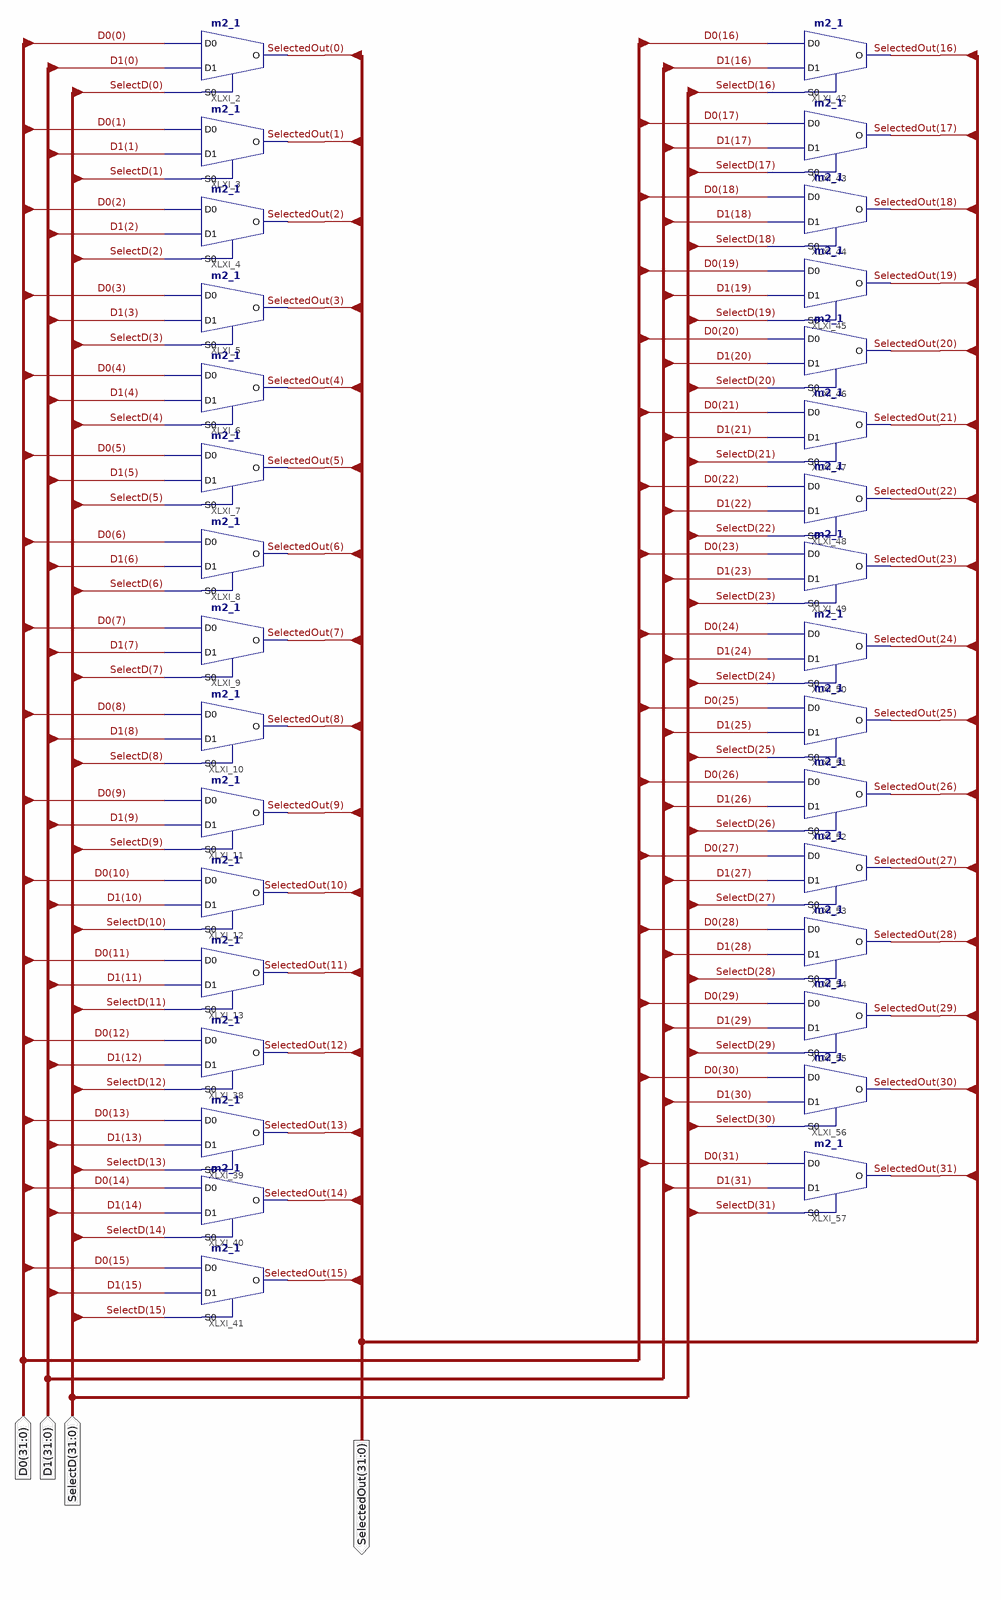
[diagram p0: schematic sheet 1]
// Xilinx ISE schematic Selector32Bit.sch (virtex4) as structural Verilog: 32 symbols, 4 ports
module Selector32Bit (
  input  [31:0] D0,
  input  [31:0] D1,
  input  [31:0] SelectD,
  output [31:0] SelectedOut
);

  m2_1 XLXI_2 (.D0(D0[0]), .D1(D1[0]), .S0(SelectD[0]), .O(SelectedOut[0]));
  m2_1 XLXI_3 (.D0(D0[1]), .D1(D1[1]), .S0(SelectD[1]), .O(SelectedOut[1]));
  m2_1 XLXI_4 (.D0(D0[2]), .D1(D1[2]), .S0(SelectD[2]), .O(SelectedOut[2]));
  m2_1 XLXI_5 (.D0(D0[3]), .D1(D1[3]), .S0(SelectD[3]), .O(SelectedOut[3]));
  m2_1 XLXI_6 (.D0(D0[4]), .D1(D1[4]), .S0(SelectD[4]), .O(SelectedOut[4]));
  m2_1 XLXI_7 (.D0(D0[5]), .D1(D1[5]), .S0(SelectD[5]), .O(SelectedOut[5]));
  m2_1 XLXI_8 (.D0(D0[6]), .D1(D1[6]), .S0(SelectD[6]), .O(SelectedOut[6]));
  m2_1 XLXI_9 (.D0(D0[7]), .D1(D1[7]), .S0(SelectD[7]), .O(SelectedOut[7]));
  m2_1 XLXI_10 (.D0(D0[8]), .D1(D1[8]), .S0(SelectD[8]), .O(SelectedOut[8]));
  m2_1 XLXI_11 (.D0(D0[9]), .D1(D1[9]), .S0(SelectD[9]), .O(SelectedOut[9]));
  m2_1 XLXI_13 (.D0(D0[11]), .D1(D1[11]), .S0(SelectD[11]), .O(SelectedOut[11]));
  m2_1 XLXI_12 (.D0(D0[10]), .D1(D1[10]), .S0(SelectD[10]), .O(SelectedOut[10]));
  m2_1 XLXI_38 (.D0(D0[12]), .D1(D1[12]), .S0(SelectD[12]), .O(SelectedOut[12]));
  m2_1 XLXI_39 (.D0(D0[13]), .D1(D1[13]), .S0(SelectD[13]), .O(SelectedOut[13]));
  m2_1 XLXI_40 (.D0(D0[14]), .D1(D1[14]), .S0(SelectD[14]), .O(SelectedOut[14]));
  m2_1 XLXI_41 (.D0(D0[15]), .D1(D1[15]), .S0(SelectD[15]), .O(SelectedOut[15]));
  m2_1 XLXI_42 (.D0(D0[16]), .D1(D1[16]), .S0(SelectD[16]), .O(SelectedOut[16]));
  m2_1 XLXI_43 (.D0(D0[17]), .D1(D1[17]), .S0(SelectD[17]), .O(SelectedOut[17]));
  m2_1 XLXI_44 (.D0(D0[18]), .D1(D1[18]), .S0(SelectD[18]), .O(SelectedOut[18]));
  m2_1 XLXI_45 (.D0(D0[19]), .D1(D1[19]), .S0(SelectD[19]), .O(SelectedOut[19]));
  m2_1 XLXI_46 (.D0(D0[20]), .D1(D1[20]), .S0(SelectD[20]), .O(SelectedOut[20]));
  m2_1 XLXI_47 (.D0(D0[21]), .D1(D1[21]), .S0(SelectD[21]), .O(SelectedOut[21]));
  m2_1 XLXI_48 (.D0(D0[22]), .D1(D1[22]), .S0(SelectD[22]), .O(SelectedOut[22]));
  m2_1 XLXI_49 (.D0(D0[23]), .D1(D1[23]), .S0(SelectD[23]), .O(SelectedOut[23]));
  m2_1 XLXI_50 (.D0(D0[24]), .D1(D1[24]), .S0(SelectD[24]), .O(SelectedOut[24]));
  m2_1 XLXI_51 (.D0(D0[25]), .D1(D1[25]), .S0(SelectD[25]), .O(SelectedOut[25]));
  m2_1 XLXI_52 (.D0(D0[26]), .D1(D1[26]), .S0(SelectD[26]), .O(SelectedOut[26]));
  m2_1 XLXI_53 (.D0(D0[27]), .D1(D1[27]), .S0(SelectD[27]), .O(SelectedOut[27]));
  m2_1 XLXI_54 (.D0(D0[28]), .D1(D1[28]), .S0(SelectD[28]), .O(SelectedOut[28]));
  m2_1 XLXI_55 (.D0(D0[29]), .D1(D1[29]), .S0(SelectD[29]), .O(SelectedOut[29]));
  m2_1 XLXI_56 (.D0(D0[30]), .D1(D1[30]), .S0(SelectD[30]), .O(SelectedOut[30]));
  m2_1 XLXI_57 (.D0(D0[31]), .D1(D1[31]), .S0(SelectD[31]), .O(SelectedOut[31]));
endmodule
